# EAGLE schematic Trafic_led (EAGLE 9.6.2)
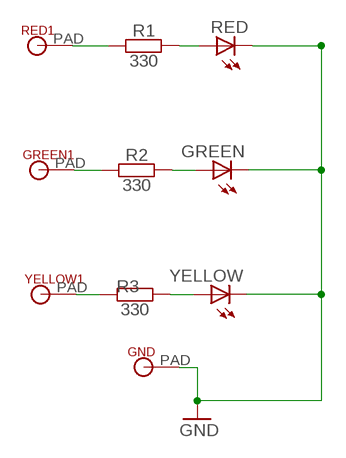
[diagram p0: schematic, sheet 1]

## Parts
GND  MICROBIT_PAD  [MICROBIT_PAD]
GREEN  LED3MM  [LED3MM]
GREEN1  MICROBIT_PAD  [MICROBIT_PAD]
R1  330  RESISTOR-07  [R0207/7]
R2  330  RESISTOR-07  [R0207/7]
R3  330  RESISTOR-07  [R0207/7]
RED  LED3MM  [LED3MM]
RED1  MICROBIT_PAD  [MICROBIT_PAD]
YELLOW  LED3MM  [LED3MM]
YELLOW1  MICROBIT_PAD  [MICROBIT_PAD]

## Nets
GND: GND.PAD GREEN.K(C) RED.K(C) YELLOW.K(C)
N$1: R1.1 RED1.PAD
N$2: R3.1 YELLOW1.PAD
N$3: GREEN.A R2.2
N$4: GREEN1.PAD R2.1
N$5: R3.2 YELLOW.A
N$6: R1.2 RED.A

## Library data of the parts
GND GREEN1 RED1 YELLOW1 = microbit:MICROBIT_PAD
GREEN RED YELLOW = adafruit:LED: LED OSRAM: - CHIPLED LG R971, LG N971, LY N971, LG Q971, LY Q971, LO R971, LY R971 LH N974, LH R974 LS Q976, LO Q976, LY Q976 LO Q996 - Hyper CHIPLED LW Q18S LB Q993, LB Q99A, LB R99A - SideLED LS A670, LO A670, LY A670, LG A670, LP A670 LB A673, LV A673, LT A673, LW A673 LH A674 LY A675 LS A676, LA A676, LO A676, LY A676, LW A676 LS A679, LY A679, LG A679 - Hyper Micro SIDELED® LS Y876, LA Y876, LO Y876, LY Y876 LT Y87S - SmartLED LW L88C, LW L88S LB L89C, LB L89S, LG L890 LS L89K, LO L89K, LY L89K LS L896, LA L896, LO L896, LY L896 - TOPLED LS T670, LO T670, LY T670, LG T670, LP T670 LSG T670, LSP T670, LSY T670, LOP T670, LYG T670 LG T671, LOG T671, LSG T671 LB T673, LV T673, LT T673, LW T673 LH T674 LS T676, LA T676, LO T676, LY T676, LB T676, LH T676, LSB T676, LW T676 LB T67C, LV T67C, LT T67C, LS T67K, LO T67K, LY T67K, LW E67C LS E67B, LA E67B, LO E67B, LY E67B, LB E67C, LV E67C, LT E67C LW T67C LS T679, LY T679, LG T679 LS T770, LO T770, LY T770, LG T770, LP T770 LB T773, LV T773, LT T773, LW T773 LH T774 LS E675, LA E675, LY E675, LS T675 LS T776, LA T776, LO T776, LY T776, LB T776 LHGB T686 LT T68C, LB T68C - Hyper Mini TOPLED® LB M676 - Mini TOPLED Santana® LG M470 LS M47K, LO M47K, LY M47K Source: http://www.osram.convergy.de/
R1-R3 = we-rcl:RESISTOR: Resistor all kinds in 0402 and 0603